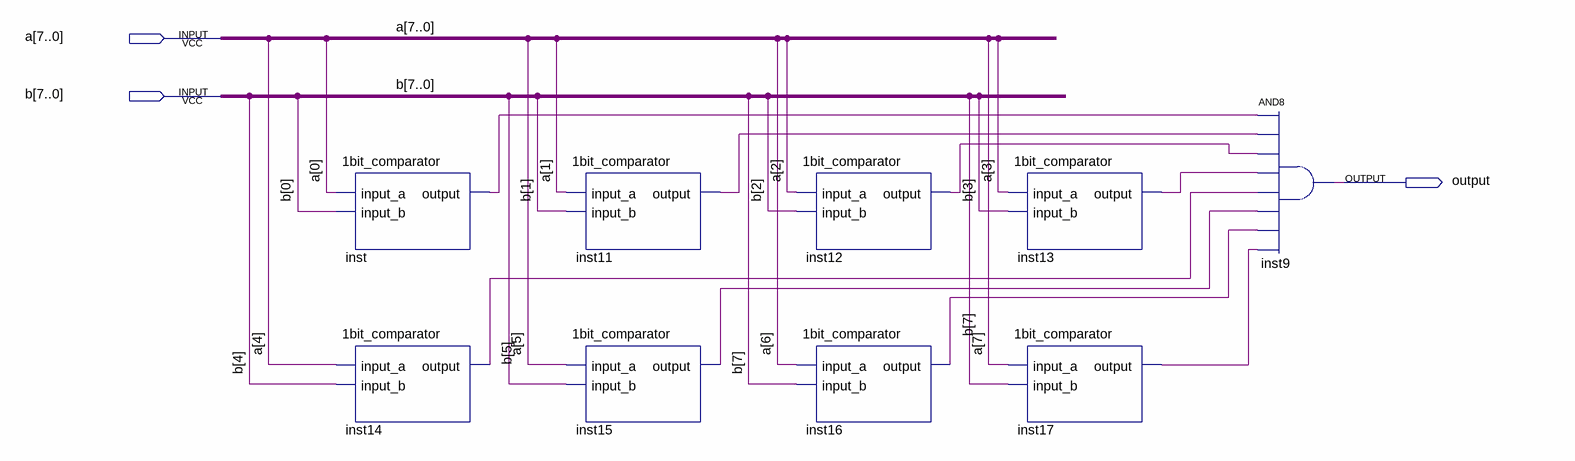
[diagram p0: schematic sheet]
// Quartus schematic 8bit_comparator.bdf as structural Verilog: 9 symbols, 3 pins
module \8bit_comparator  (
  input  [7:0] a,
  input  [7:0] b,
  output \output 
);

  wire inst11_output, inst12_output, inst13_output, inst14_output, inst15_output, inst16_output,
       inst17_output, inst_output;

  \1bit_comparator  inst (.input_a(a[0]), .input_b(b[0]), .\output (inst_output));
  \1bit_comparator  inst14 (.input_a(a[4]), .input_b(b[4]), .\output (inst14_output));
  \1bit_comparator  inst11 (.input_a(a[1]), .input_b(b[1]), .\output (inst11_output));
  \1bit_comparator  inst15 (.input_a(a[5]), .input_b(b[5]), .\output (inst15_output));
  \1bit_comparator  inst12 (.input_a(a[2]), .input_b(b[2]), .\output (inst12_output));
  \1bit_comparator  inst16 (.input_a(a[6]), .input_b(b[7]), .\output (inst16_output));
  \1bit_comparator  inst13 (.input_a(a[3]), .input_b(b[3]), .\output (inst13_output));
  \1bit_comparator  inst17 (.input_a(a[7]), .input_b(b[7]), .\output (inst17_output));
  and inst9 (\output , inst_output, inst11_output, inst12_output, inst13_output, inst14_output, inst15_output, inst16_output, inst17_output);
endmodule
